# EAGLE schematic ZVS Flyback Driver Circuit (EAGLE 9.0.1)
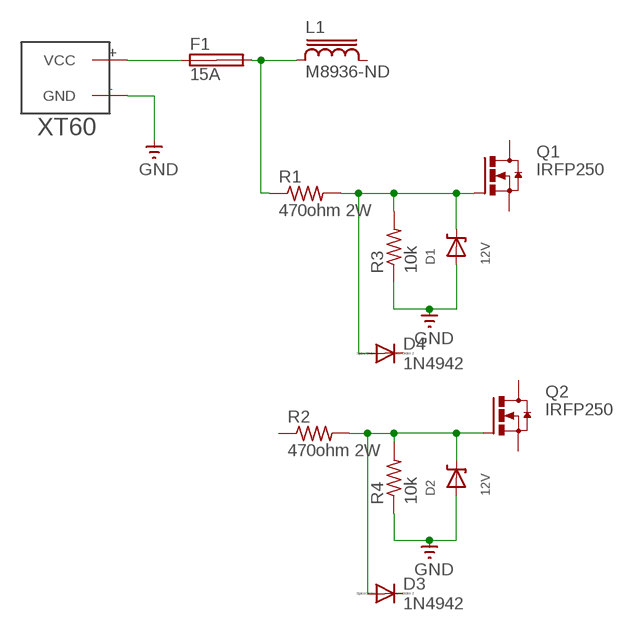
[diagram p0: schematic, sheet 1]

## Parts
D1  12V  DIODE-ZENER  [SMADIODE]
D2  12V  DIODE-ZENER  [SMADIODE]
D3  1N4942  [DO41-10]
D4  1N4942  [DO41-10]
F1  15A  SHK20L  [SHK20L]
L1  M8936-ND  2300-V  [2320-V-RC]
Q1  IRFP250  [TO-247AD-V]
Q2  IRFP250  [TO-247AD-V]
R1  470ohm 2W  R-US_0617/22  [0617/22]
R2  470ohm 2W  R-US_0617/22  [0617/22]
R3  10k  R-US_M0805  [M0805]
R4  10k  R-US_M0805  [M0805]
U$1  XT60  [XT60]

## Nets
GND: D1.A D2.A R3.1 R4.1 U$1.-(GND)
N$1: F1.1A U$1.+(VCC)
N$2: F1.2A L1.1 R1.1
N$3: D1.C D4.A Q1.G R1.2 R3.2
N$5: D2.C D3.A Q2.G R2.2 R4.2
Unconnected: D3.C D4.C F1.1B F1.2B L1.2 Q1.D Q1.S Q2.D Q2.S R2.1

## Library data of the parts
D1 D2 = microbuilder:DIODE-ZENER: Zener Diode SMA: 30V 1W Zener Diode, 1.2Vf - Digikey: SMAZ30-FDICT-ND
D3 D4 = diode:1N4942: DIODE 1.0 A, 200 V, 150 ns
F1 = fuse:SHK20L: FUSE HOLDER 5 x 20 mm, SH contact, SHH1 Schukat, E1073 Buerklin; OC_FARNELL: unknown; OC_NEWARK: unknown
L1 = inductor-bourns:2300-: TOROID INDUCTOR
Q1 Q2 = transistor-power:IRFP25*: 33A/27A, 200V/150V, 0.085/0.012 Ohm, N-Channel Power MOSFET Source: Fairchild Semiconductor Corporation
R1-R4 = adafruit:R-US_: RESISTOR, American symbol
U$1 = XT60:XT60: XT60